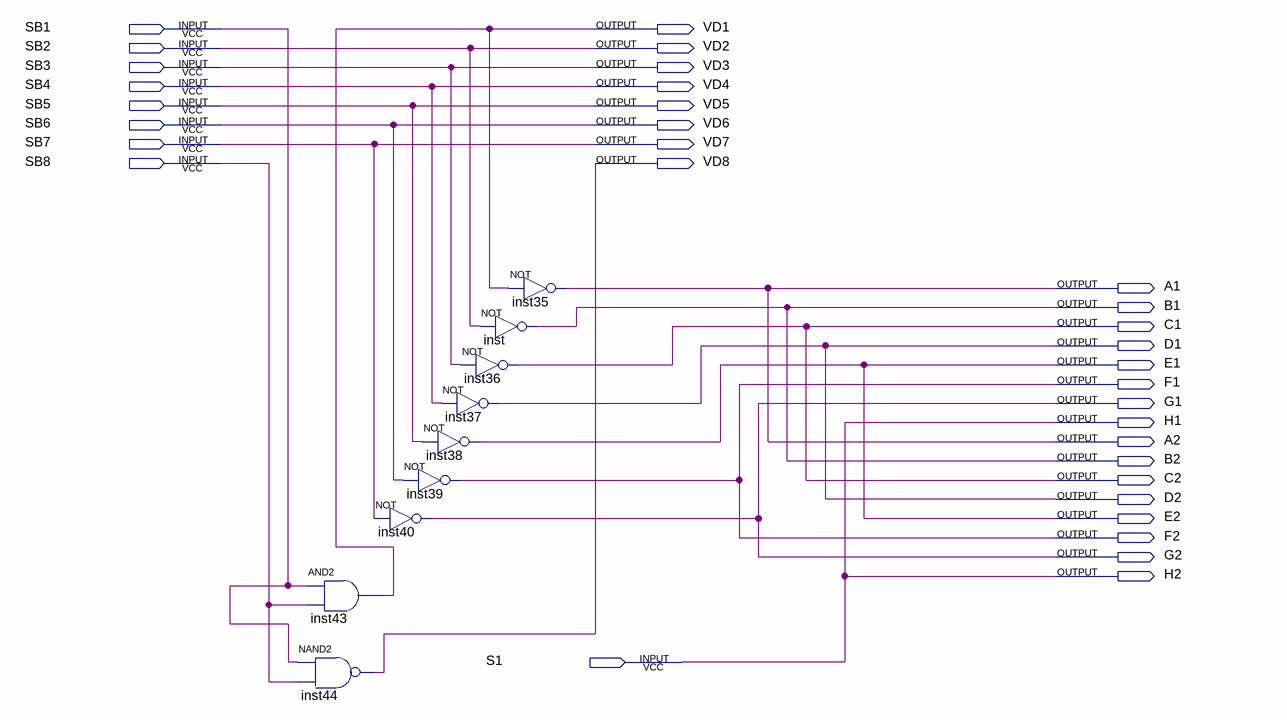
[diagram p0: schematic sheet]
// Quartus schematic cb3.bdf as structural Verilog: 9 symbols, 33 pins
module cb3 (
  input  SB1,
  input  SB2,
  input  SB3,
  input  SB4,
  input  SB5,
  input  SB6,
  input  SB7,
  input  SB8,
  input  S1,
  output VD1,
  output VD2,
  output VD3,
  output VD4,
  output VD5,
  output VD6,
  output VD7,
  output VD8,
  output A1,
  output B1,
  output C1,
  output D1,
  output E1,
  output F1,
  output G1,
  output H1,
  output A2,
  output B2,
  output C2,
  output D2,
  output E2,
  output F2,
  output G2,
  output H2
);

  and inst43 (VD1, SB1, SB8);
  nand inst44 (VD8, SB1, SB8);
  not inst38 (E1, SB5);
  not inst39 (F1, SB6);
  not inst40 (G1, SB7);
  not inst35 (A1, VD1);
  not inst (B1, SB2);
  not inst36 (C1, SB3);
  not inst37 (D1, SB4);

  assign A2 = A1;
  assign B2 = B1;
  assign C2 = C1;
  assign D2 = D1;
  assign E2 = E1;
  assign F2 = F1;
  assign G2 = G1;
  assign H1 = S1;
  assign H2 = S1;
  assign VD2 = SB2;
  assign VD3 = SB3;
  assign VD4 = SB4;
  assign VD5 = SB5;
  assign VD6 = SB6;
  assign VD7 = SB7;
endmodule
